# Altium schematic sheet [00] Power.SchDoc
size A
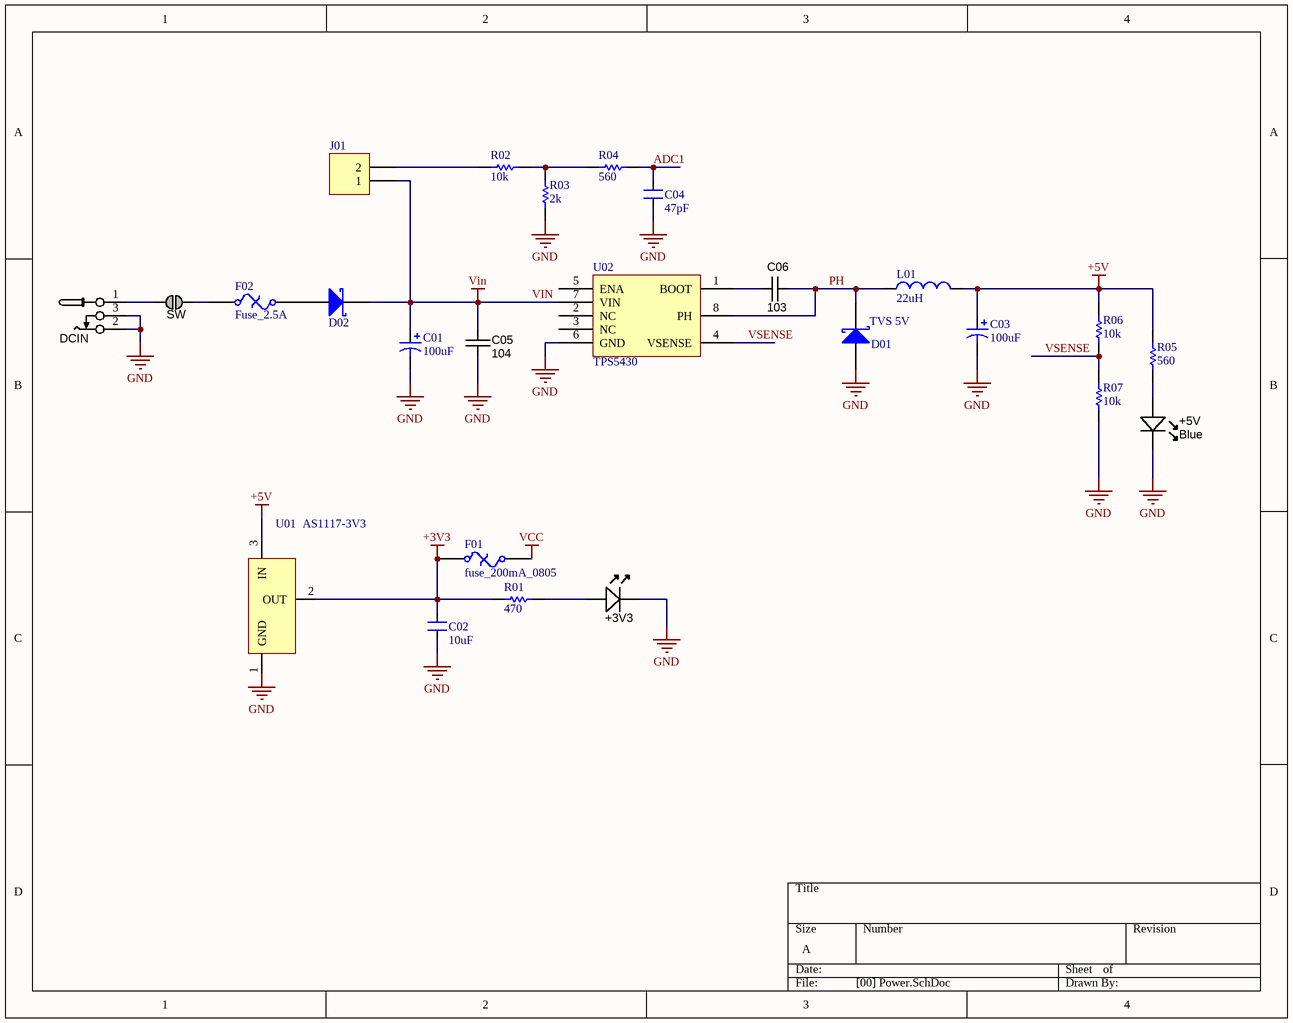
[diagram p0: [00] Power.SchDoc]

## Parts
+3V3  Blue  [LED-0805-K]  (value not drawn)
+5V  Blue  [LED-0805-K]
C01  value 100uF  [CAPE3.5-5.0MM_Rad_10x14mm]  (hidden comment: Cap)
C02  value 10uF  [CAPMP3528X210N]  (hidden comment: Cap_10uF)
C03  value 100uF  [CAPE3.5-5.0MM_Rad_10x14mm]  (hidden comment: Cap)
C04  value 47pF  [CAPC1608N]  (hidden comment: Cap_103_0603)
C05  value 104  [CAPC1608N]  (hidden comment: approved sub OK)
C06  value 103  [CAPC1608N]  (hidden comment: approved sub OK)
D01  TVS 5V  [SMD diode]
D02  SS14  [DO-214AC]  (value not drawn)
DCIN  CONN_PWR_JACK_2.1x5.5mm  [CONN_PWR_JACK_2.1x5.5mm]  (value not drawn)
F01  fuse_200mA_0805  [SMD 1206]
F02  Fuse_2.5A  [FUSE_SR-5-BK]
J01  Header 2  [HDR1X2]  (value not drawn)
L01  value 22uH  [Inductor 12x12x6]  (hidden comment: Inductor)
R01  value 470  [RESC1608N_F]  (hidden comment: Res_560_0603)
R02  value 10k  [RESC1608N_F]  (hidden comment: Res_10k_0603)
R03  value 2k  [RESC1608N_F]  (hidden comment: Res_2k_0603)
R04  value 560  [RESC1608N_F]  (hidden comment: Res_560_0603)
R05  value 560  [RESC1608N_ZERO]  (hidden comment: Res)
R06  value 10k  [RESC1608N_ZERO]  (hidden comment: Res)
R07  value 10k  [RESC1608N_ZERO]  (hidden comment: Res)
SW  Jumper  [JUMP1]  (value not drawn)  (no BOM)
U01  AS1117-3V3  [SOT223-4N]
U02  TPS5430  [SOIC127P600X175-8AN]

## Nets
+3V3: C02.2 F01.1 R01.2 U01.2(OUT)
+5V: C03.1 L01.2 R05.2 R06.2 U01.3(IN)
GND: +3V3.K +5V.K C01.2 C02.1 C03.2 C04.1 C05.2 D01.1(A) DCIN.2 DCIN.3 R03.1 R07.1 U01.1(GND) U02.6(GND)
VCC: F01.2
VIN: C01.1 C05.1 D02.2(K) J01.1 U02.7(VIN)
ADC1: C04.2 R04.1
PH: C06.2 D01.2(K) L01.1 U02.8(PH)
VSENSE: R06.1 R07.2 U02.4(VSENSE)
Net+3V3_A: +3V3.A R01.1
Net+5V_A: +5V.A R05.1
NetC06_1: C06.1 U02.1(BOOT)
NetD02_1: D02.1(A) F02.1
NetDCIN_1: DCIN.1 SW.2
NetF02_2: F02.2 SW.1
NetJ01_2: J01.2 R02.2
NetR02_1: R02.1 R03.2 R04.2

Not connected (* = marked no-connect by the designer): U02 2(NC) 3(NC) 5(ENA)

## Library data of the parts
+3V3 +5V = LED_SMD_Blue_0805_100mcd: LED 0805 SMD Blue 100mcd 470nm; Manufacturer 1: Ligitek; Manufacturer Part Number 1: LG-170DBKZ-CT; Ratings: 100 mcd; 470 nm; Package / Case: 0805; Material: InGaN/GaN; Value: Blue; Color: Blue
C02 C04 = CAP NP
C05 C06 = CAPC_1n_0603_100V: Capacitor SMD Cer 1nF 10% 100V X7R 0603; Manufacturer 1: Murata Electronics North America; Manufacturer Part Number 1: GCM188R72A102KA37D; Ratings: 100V; X7R; Material: ceramic; Package / Case: 0603 (1608 metric); Tolerance: ±10%; Supplier 1: Digi-Key; Supplier Part Number 1: 490-4780-1-ND; Operating Temperature: -55°C ~ 125°C; Size / Dimension: 0.063" L x 0.031" W (1.60mm x 0.80mm); Thickness (Max): 0.035" (0.90mm); ComponentLink1URL: http://search.murata.co.jp/Ceramy/image/img/PDF/ENG/GCM188R72A102KA37.pdf; ComponentLink1Description: http://search.murata.co.jp/Ceramy/image/img/PDF/ENG/GCM188R72A102KA37.pdf
D01 D02 = Diode: pin to pad: 1>A 2>K
DCIN = CONN_PWR_JACK_2.1x5.5mm: Power Connector, THT, 2.1mm ID, 5.5mm OD; Manufacturer 1: CUI Inc; Manufacturer Part Number 1: PJ-102AH; Category: Connectors; Mounting Type: Through Hole; Package / Case: PCB mount; Value: 2.1mm ID, 5.5mm OD; Supplier 1: Digi-Key; Supplier Part Number 1: CP-102AH-ND
F01 F02 = Fuse Thermal: Thermal Fuse; Published: 24-Mar-1999; LatestRevisionDate: 17-Jul-2002; LatestRevisionNote: Re-released for DXP Platform.; PackageReference: PIN-W2/E2.8; Publisher: Altium Limited; PackageDescription: Thru-Hole; 2 Leads
J01 = Header 2: Header, 2-Pin; LatestRevisionDate: 17-Jul-2002; LatestRevisionNote: Re-released for DXP Platform.; Publisher: Altium Limited
R01 R02 R03 R04 = Res
SW = JUMP1: SMD jumper
U01 = AS1117: pin to pad: 2>2+4